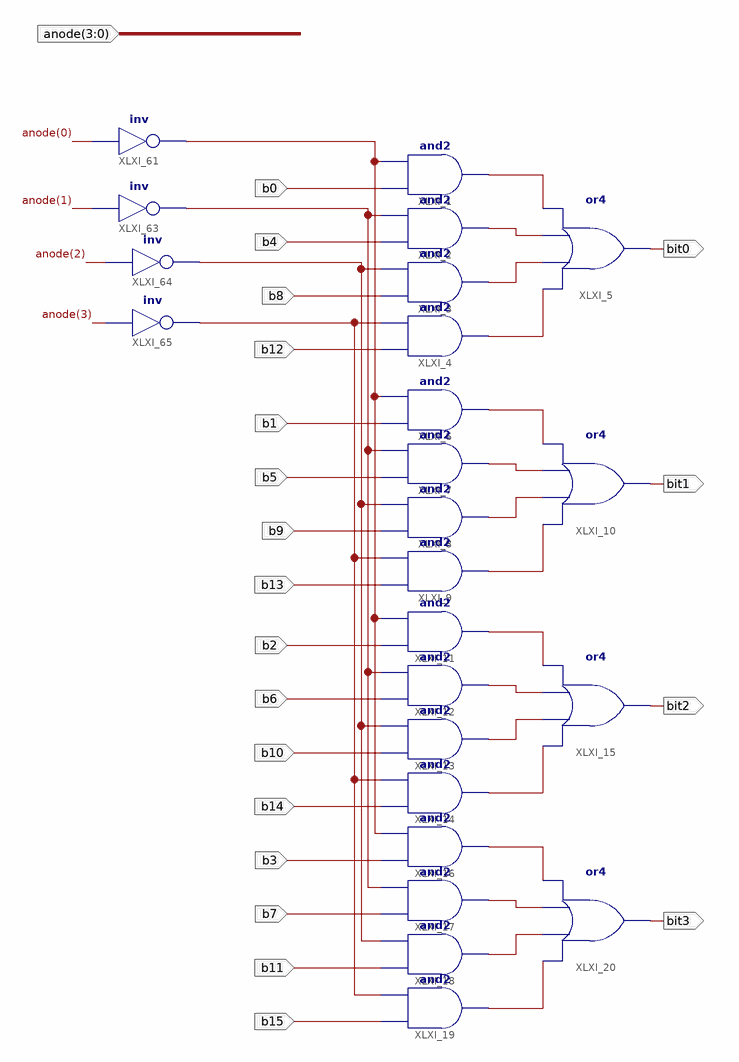
[diagram p0: schematic sheet 1]
// Xilinx ISE schematic Mux.sch (artix7) as structural Verilog: 24 symbols, 21 ports
module Mux (
  input  [3:0] anode,
  input  b0,
  input  b4,
  input  b8,
  input  b12,
  input  b1,
  input  b5,
  input  b9,
  input  b13,
  input  b2,
  input  b6,
  input  b10,
  input  b14,
  input  b3,
  input  b7,
  input  b11,
  input  b15,
  output bit0,
  output bit1,
  output bit2,
  output bit3
);

  wire XLXN_1, XLXN_2, XLXN_3, XLXN_4, XLXN_11, XLXN_12, XLXN_13, XLXN_14, XLXN_20, XLXN_21, XLXN_22,
       XLXN_27, XLXN_28, XLXN_29, XLXN_30, XLXN_113, XLXN_125, XLXN_130, XLXN_133, XLXN_136;

  and XLXI_1 (XLXN_1, b0, XLXN_113);
  and XLXI_2 (XLXN_2, b4, XLXN_125);
  and XLXI_3 (XLXN_3, b8, XLXN_130);
  and XLXI_4 (XLXN_4, b12, XLXN_133);
  or XLXI_5 (bit0, XLXN_4, XLXN_3, XLXN_2, XLXN_1);
  and XLXI_6 (XLXN_11, b1, XLXN_113);
  and XLXI_7 (XLXN_12, b5, XLXN_125);
  and XLXI_8 (XLXN_13, b9, XLXN_130);
  and XLXI_9 (XLXN_14, b13, XLXN_133);
  or XLXI_10 (bit1, XLXN_14, XLXN_13, XLXN_12, XLXN_11);
  and XLXI_11 (XLXN_136, b2, XLXN_113);
  and XLXI_12 (XLXN_20, b6, XLXN_125);
  and XLXI_13 (XLXN_21, b10, XLXN_130);
  and XLXI_14 (XLXN_22, b14, XLXN_133);
  or XLXI_15 (bit2, XLXN_22, XLXN_21, XLXN_20, XLXN_136);
  and XLXI_16 (XLXN_27, b3, XLXN_113);
  and XLXI_17 (XLXN_28, b7, XLXN_125);
  and XLXI_18 (XLXN_29, b11, XLXN_130);
  and XLXI_19 (XLXN_30, b15, XLXN_133);
  or XLXI_20 (bit3, XLXN_30, XLXN_29, XLXN_28, XLXN_27);
  not XLXI_61 (XLXN_113, anode[0]);
  not XLXI_63 (XLXN_125, anode[1]);
  not XLXI_64 (XLXN_130, anode[2]);
  not XLXI_65 (XLXN_133, anode[3]);
endmodule
